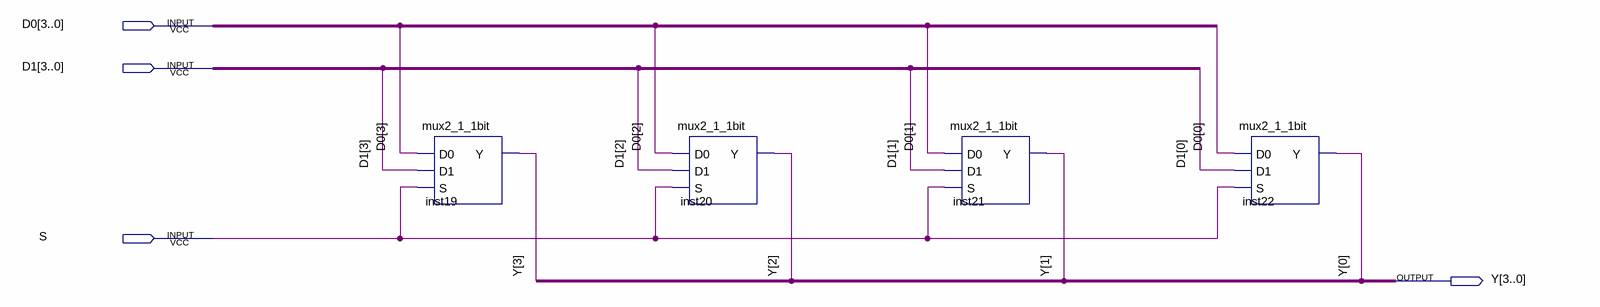
[diagram p0: schematic sheet]
// Quartus schematic mux2_1_4bit.bdf as structural Verilog: 4 symbols, 4 pins
module mux2_1_4bit (
  input  [3:0] D0,
  input  [3:0] D1,
  input  S,
  output [3:0] Y
);

  mux2_1_1bit inst19 (.D0(D0[3]), .D1(D1[3]), .S(S), .Y(Y[3]));
  mux2_1_1bit inst20 (.D0(D0[2]), .D1(D1[2]), .S(S), .Y(Y[2]));
  mux2_1_1bit inst21 (.D0(D0[1]), .D1(D1[1]), .S(S), .Y(Y[1]));
  mux2_1_1bit inst22 (.D0(D0[0]), .D1(D1[0]), .S(S), .Y(Y[0]));
endmodule
